# EAGLE design tinyTorch (EAGLE 7.5.0)
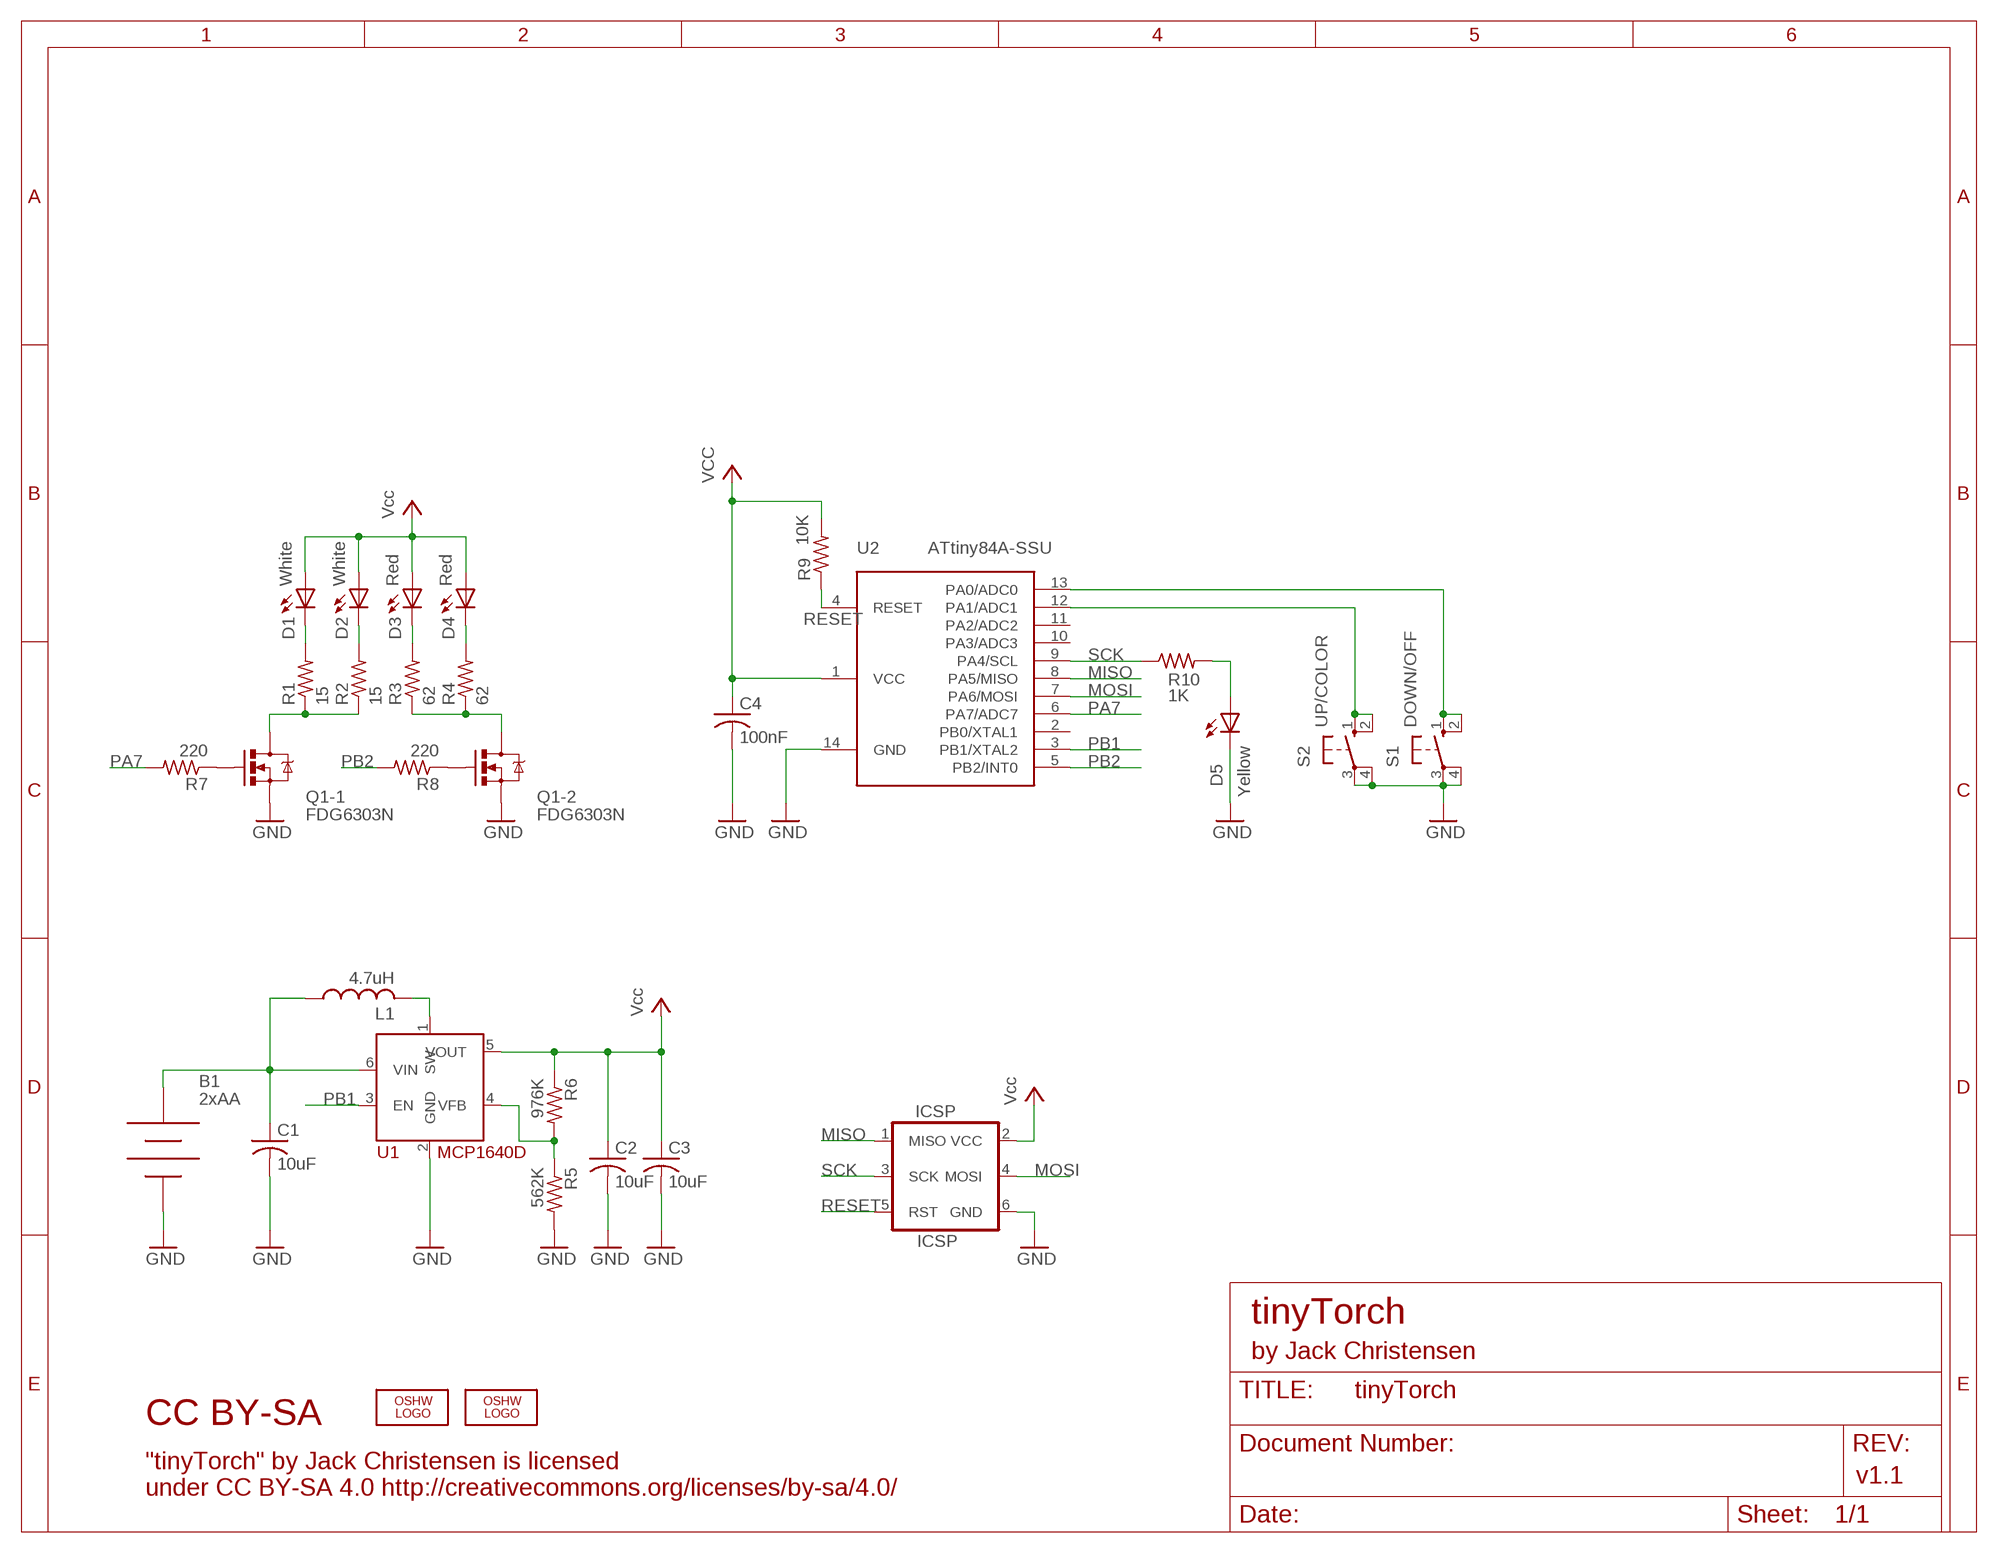
[diagram p0: schematic, sheet 1]

## Parts
B1  2xAA  BATTERY-2AANOHOLES  [KEYSTONE-2462-NO-HOLES]
C1  10uF  C-USM0805  [M0805]
C2  10uF  C-USM0805  [M0805]
C3  10uF  C-USM0805  [M0805]
C4  100nF  C-USM0805  [M0805]
D1  White  LED5MM-LONGPADS  [LED5MM-OVAL]
D2  White  LED5MM-LONGPADS  [LED5MM-OVAL]
D3  Red  LED5MM-LONGPADS  [LED5MM-OVAL]
D4  Red  LED5MM-LONGPADS  [LED5MM-OVAL]
D5  Yellow  LEDD0805A  [D0805A]
ICSP  ICSP  AVR_SPI_PRG_62X3_LOCK  [2X3_LOCK]
L1  4.7uH  INDUCTORC1210K  [C1210K]
LOGO1  OSHW_LOGO_8MILX0150-NT  [OSHW_8X150_NOTEXT]
LOGO2  OSHW_LOGO_10MILX0200-NT  [OSHW_10X200_NOTEXT]
Q1  FDG6303N  DUAL-MOSFET  [SOT363_PHILIPS]
R1  15  R-US_M0805  [M0805]
R2  15  R-US_M0805  [M0805]
R3  62  R-US_M0805  [M0805]
R4  62  R-US_M0805  [M0805]
R5  562K  R-US_M0805  [M0805]
R6  976K  R-US_M0805  [M0805]
R7  220  R-US_M0805  [M0805]
R8  220  R-US_M0805  [M0805]
R9  10K  R-US_M0805  [M0805]
R10  1K  R-US_M0805  [M0805]
S1  DOWN/OFF  10-XXSMT  [TACT-SW-SMT]
S2  UP/COLOR  10-XXSMT  [TACT-SW-SMT]
U1  MCP1640D  MCP1640  [SOT23-6]
U2  ATtiny84A-SSU  ATTINYX4SO14  [SO14]

## Nets
GND: B1.NEG C1.2 C2.2 C3.2 C4.2 D5.K(C) ICSP.6(GND) Q1.1(-1:S) Q1.4(-2:S) R5.2 S1.3(P) S1.4(P1) S2.3(P) S2.4(P1) U1.2(GND) U2.14(GND)
MISO: ICSP.1(MISO) U2.8(PA5/MISO)
MOSI: ICSP.4(MOSI) U2.7(PA6/MOSI)
N$1: Q1.2(-1:G) R7.1
N$2: R5.1 R6.2 U1.4(VFB)
N$3: Q1.5(-2:G) R8.1
N$4: D1.K(C) R1.2
N$5: D5.A R10.2
N$7: L1.2 U1.1(SW)
N$8: D4.K(C) R4.2
N$9: D2.K(C) R2.2
N$10: D3.K(C) R3.2
N$11: B1.POS C1.1 L1.1 U1.6(VIN)
N$13: Q1.6(-1:D) R1.1 R2.1
N$14: Q1.3(-2:D) R3.1 R4.1
N$15: S1.1(S) S1.2(S1) U2.13(PA0/ADC0)
N$16: S2.1(S) S2.2(S1) U2.12(PA1/ADC1)
PA7: R7.2 U2.6(PA7/ADC7)
PB1: U1.3(EN) U2.3(PB1/XTAL2)
PB2: R8.2 U2.5(PB2/INT0)
RESET: ICSP.5(RST) R9.1 U2.4(RESET)
SCK: ICSP.3(SCK) R10.1 U2.9(PA4/SCL)
VCC: C2.1 C3.1 C4.1 D1.A D2.A D3.A D4.A ICSP.2(VCC) R6.1 R9.2 U1.5(VOUT) U2.1(VCC) ; supply symbol labelled Vcc
Unconnected: U2.2(PB0/XTAL1) U2.10(PA3/ADC3) U2.11(PA2/ADC2)

## Notes on the sheet
- tinyTorch
- by Jack Christensen
- CC BY-SA
- v1.1
- "tinyTorch" by Jack Christensen is licensed
  under CC BY-SA 4.0 http://creativecommons.org/licenses/by-sa/4.0/

## Library data of the parts
B1 = _jc:BATTERY-2AA; MFR: Keystone; MFR-PART-NO: 2462
C1-C4 = _jc:C-US: CAPACITOR, American symbol
D1 D2 = _jc:LED: LED OSRAM: - CHIPLED LG R971, LG N971, LY N971, LG Q971, LY Q971, LO R971, LY R971 LH N974, LH R974 LS Q976, LO Q976, LY Q976 LO Q996 - Hyper CHIPLED LW Q18S LB Q993, LB Q99A, LB R99A - SideLED LS A670, LO A670, LY A670, LG A670, LP A670 LB A673, LV A673, LT A673, LW A673 LH A674 LY A675 LS A676, LA A676, LO A676, LY A676, LW A676 LS A679, LY A679, LG A679 - Hyper Micro SIDELED® LS Y876, LA Y876, LO Y876, LY Y876 LT Y87S - SmartLED LW L88C, LW L88S LB L89C, LB L89S, LG L890 LS L89K, LO L89K, LY L89K LS L896, LA L896, LO L896, LY L896 - TOPLED LS T670, LO T670, LY T670, LG T670, LP T670 LSG T670, LSP T670, LSY T670, LOP T670, LYG T670 LG T671, LOG T671, LSG T671 LB T673, LV T673, LT T673, LW T673 LH T674 LS T676, LA T676, LO T676, LY T676, LB T676, LH T676, LSB T676, LW T676 LB T67C, LV T67C, LT T67C, LS T67K, LO T67K, LY T67K, LW E67C LS E67B, LA E67B, LO E67B, LY E67B, LB E67C, LV E67C, LT E67C LW T67C LS T679, LY T679, LG T679 LS T770, LO T770, LY T770, LG T770, LP T770 LB T773, LV T773, LT T773, LW T773 LH T774 LS E675, LA E675, LY E675, LS T675 LS T776, LA T776, LO T776, LY T776, LB T776 LHGB T686 LT T68C, LB T68C - Hyper Mini TOPLED® LB M676 - Mini TOPLED Santana® LG M470 LS M47K, LO M47K, LY M47K Source: http://www.osram.convergy.de/; MFR: Cree; MFR-PART-NO: C503D-WAN-CCBEB151
D3 D4 = _jc:LED: LED OSRAM: - CHIPLED LG R971, LG N971, LY N971, LG Q971, LY Q971, LO R971, LY R971 LH N974, LH R974 LS Q976, LO Q976, LY Q976 LO Q996 - Hyper CHIPLED LW Q18S LB Q993, LB Q99A, LB R99A - SideLED LS A670, LO A670, LY A670, LG A670, LP A670 LB A673, LV A673, LT A673, LW A673 LH A674 LY A675 LS A676, LA A676, LO A676, LY A676, LW A676 LS A679, LY A679, LG A679 - Hyper Micro SIDELED® LS Y876, LA Y876, LO Y876, LY Y876 LT Y87S - SmartLED LW L88C, LW L88S LB L89C, LB L89S, LG L890 LS L89K, LO L89K, LY L89K LS L896, LA L896, LO L896, LY L896 - TOPLED LS T670, LO T670, LY T670, LG T670, LP T670 LSG T670, LSP T670, LSY T670, LOP T670, LYG T670 LG T671, LOG T671, LSG T671 LB T673, LV T673, LT T673, LW T673 LH T674 LS T676, LA T676, LO T676, LY T676, LB T676, LH T676, LSB T676, LW T676 LB T67C, LV T67C, LT T67C, LS T67K, LO T67K, LY T67K, LW E67C LS E67B, LA E67B, LO E67B, LY E67B, LB E67C, LV E67C, LT E67C LW T67C LS T679, LY T679, LG T679 LS T770, LO T770, LY T770, LG T770, LP T770 LB T773, LV T773, LT T773, LW T773 LH T774 LS E675, LA E675, LY E675, LS T675 LS T776, LA T776, LO T776, LY T776, LB T776 LHGB T686 LT T68C, LB T68C - Hyper Mini TOPLED® LB M676 - Mini TOPLED Santana® LG M470 LS M47K, LO M47K, LY M47K Source: http://www.osram.convergy.de/; MFR: Lite-On; MFR-PART-NO: LTL2H3EZ1K
D5 = _jc:LED: LED OSRAM: - CHIPLED LG R971, LG N971, LY N971, LG Q971, LY Q971, LO R971, LY R971 LH N974, LH R974 LS Q976, LO Q976, LY Q976 LO Q996 - Hyper CHIPLED LW Q18S LB Q993, LB Q99A, LB R99A - SideLED LS A670, LO A670, LY A670, LG A670, LP A670 LB A673, LV A673, LT A673, LW A673 LH A674 LY A675 LS A676, LA A676, LO A676, LY A676, LW A676 LS A679, LY A679, LG A679 - Hyper Micro SIDELED® LS Y876, LA Y876, LO Y876, LY Y876 LT Y87S - SmartLED LW L88C, LW L88S LB L89C, LB L89S, LG L890 LS L89K, LO L89K, LY L89K LS L896, LA L896, LO L896, LY L896 - TOPLED LS T670, LO T670, LY T670, LG T670, LP T670 LSG T670, LSP T670, LSY T670, LOP T670, LYG T670 LG T671, LOG T671, LSG T671 LB T673, LV T673, LT T673, LW T673 LH T674 LS T676, LA T676, LO T676, LY T676, LB T676, LH T676, LSB T676, LW T676 LB T67C, LV T67C, LT T67C, LS T67K, LO T67K, LY T67K, LW E67C LS E67B, LA E67B, LO E67B, LY E67B, LB E67C, LV E67C, LT E67C LW T67C LS T679, LY T679, LG T679 LS T770, LO T770, LY T770, LG T770, LP T770 LB T773, LV T773, LT T773, LW T773 LH T774 LS E675, LA E675, LY E675, LS T675 LS T776, LA T776, LO T776, LY T776, LB T776 LHGB T686 LT T68C, LB T68C - Hyper Mini TOPLED® LB M676 - Mini TOPLED Santana® LG M470 LS M47K, LO M47K, LY M47K Source: http://www.osram.convergy.de/; MFR: Lite-On; MFR-PART-NO: LTST-C171KYKT
ICSP = _jc:AVR_SPI_PRG_6: AVR ISP 6 Pin This is the reduced ISP connector for AVR programming. Common on Arduino. This footprint will take up less PCB space and can be used with a 10-pin to 6-pin adapter such as SKU: BOB-08508
L1 = _jc:INDUCTOR: Murata #11R472C; MFR: Taiyo Yuden; MFR-PART-NO: CBC3225T4R7MR
LOGO1 = ohw-logo:OSHW_LOGO_8MIL
LOGO2 = ohw-logo:OSHW_LOGO_10MIL
Q1 = _jc:DUAL-MOSFET: e.g. Fairchild/ON Semi FDG6303N
R1-R10 = _jc:R-US_: RESISTOR, American symbol
S1 S2 = _jc:10-XX: OMRON SWITCH; MFR: Omron; MFR-PART-NO: B3FS-1000
U1 = _jc:MCP1640
U2 = _jc:ATTINYX4

## Board
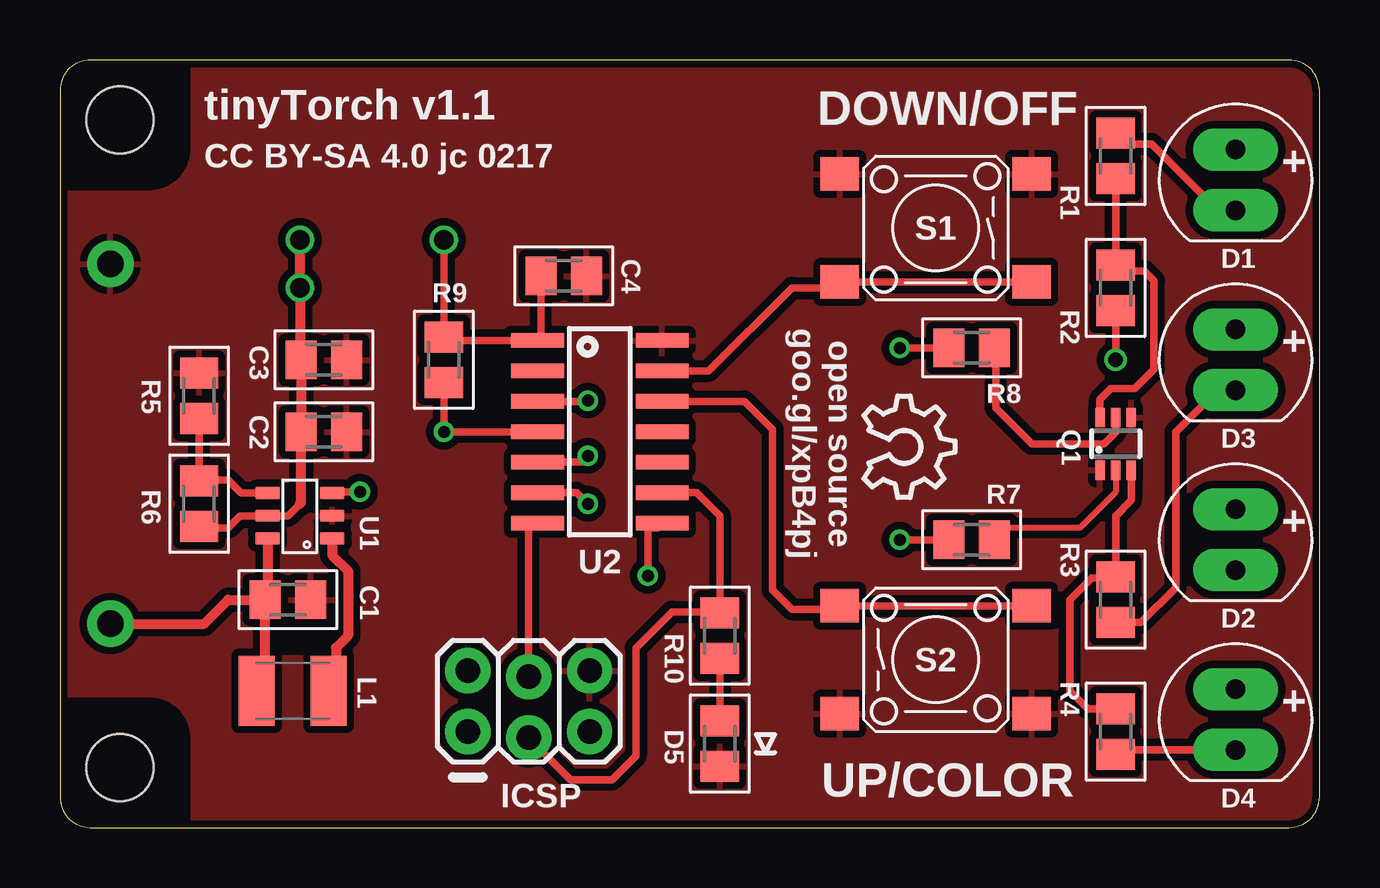
[diagram p1: board, top side]
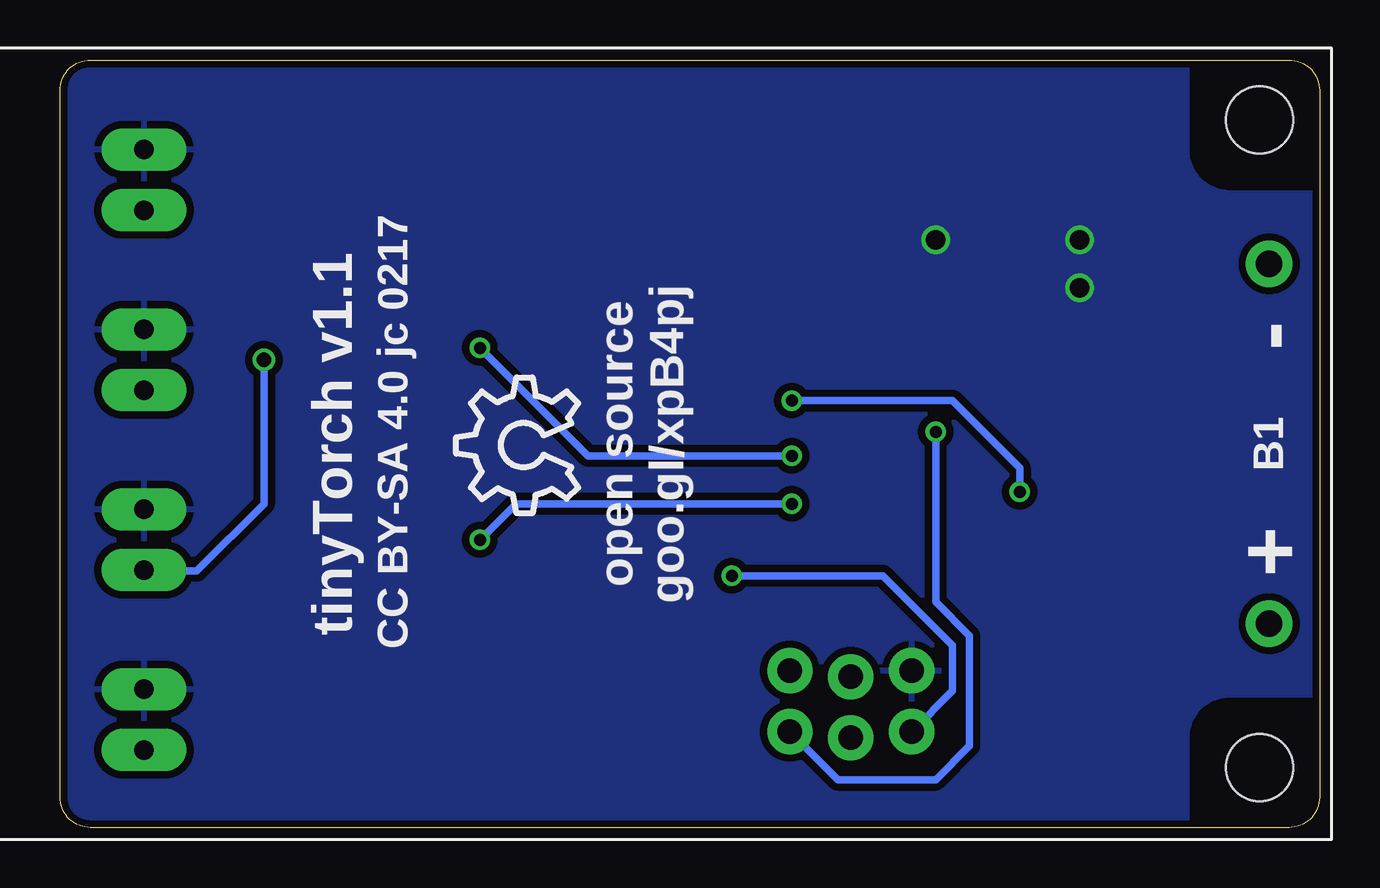
[diagram p2: board, bottom side, seen from below]

Size 52.5 x 32 mm. Coordinates in mm from the lower left corner, seen from the top.
Outline: 0,30.73 0,1.27 arc90 1.27,0 51.23,0 arc90 52.5,1.27 52.5,30.73 arc90 51.23,32 1.27,32 arc90 0,30.73
Copper layers (1*16): Top 0.0356mm / dielectric 1.5011mm / Bottom 0.0356mm
Design rules "oshpark-2layer-jc *": minimum track width 8mil, minimum drill 13mil, track to track 8mil, track to pad 8mil, pad to pad 8mil, via to via 8mil, smd to smd 6mil, copper to edge 12mil, drill to drill 6mil, minimum pad ring 7mil, minimum via ring 7mil, stop-mask expansion 2.5mil, vias tented up to drill 20mil, thermal gap 12mil
Holes 2.8 mm at 2.5,2.5 2.5,29.5
tRestrict: area 9,7.5 to 11,8.5; area 0,27 to 5,32; area 0,0 to 5,5
bRestrict: area 0,27 to 5,32; area 0,0 to 5,5

### Footprints (pad centres in the part's own frame; a part is rotated, then mirrored left to right if it is on the bottom)
KEYSTONE-2462-NO-HOLES = drill 1.1 pad 1.93: NEG 2.6,-7.5; POS 2.6,7.5
M0805 = smd 1.3 x 1.6: 1 -0.95,0; 2 0.95,0
LED5MM-OVAL = drill 0.813 pad 1.778 long: A -1.27,0; K 1.27,0
D0805A = smd 1.3 x 1.6: A -0.95,0; K 0.95,0
2X3_LOCK = drill 1.016 pad 1.88: 1 0,0; 2 0,2.54; 3 2.54,-0.254; 4 2.54,2.286; 5 5.08,0; 6 5.08,2.54
C1210K = smd 1.5 x 2.9: 1 -1.5,0; 2 1.5,0
SOT363_PHILIPS = smd 0.4 x 0.8: 1 -0.65,-1.1; 2 0,-1.1; 3 0.65,-1.1; 4 0.65,1.1; 5 0,1.1; 6 -0.65,1.1
TACT-SW-SMT = smd 1.6 x 1.4: 1 -4,2.25; 2 4,2.25; 3 -4,-2.25; 4 4,-2.25
SOT23-6 = smd 0.508 x 1.016: 1 -0.95,-1.35; 2 0,-1.35; 3 0.95,-1.35; 4 0.95,1.35; 5 0,1.35; 6 -0.95,1.35
SO14 = smd 0.6 x 2.2: 1 -3.81,-2.6; 2 -2.54,-2.6; 3 -1.27,-2.6; 4 0,-2.6; 5 1.27,-2.6; 6 2.54,-2.6; 7 3.81,-2.6; 8 3.81,2.6; 9 2.54,2.6; 10 1.27,2.6; 11 0,2.6; 12 -1.27,2.6; 13 -2.54,2.6; 14 -3.81,2.6

### Placement (x,y rotation side)
B1  -0.5,16 180 bottom
C1  9.5,9.5 0 top
C2  11,16.5 0 top
C3  11,19.5 0 top
C4  21,23 0 top
D1  49,27 270 top
D2  49,12 270 top
D3  49,19.5 270 top
D4  49,4.5 270 top
D5  27.5,3.5 270 top
ICSP  17,4 0 top
L1  9.7,5.7 0 top
LOGO1  33.5,18 270 top
LOGO2  30.9,13.1 90 bottom
Q1  44,16 0 top
R1  44,28 90 top
R2  44,22.5 270 top
R3  44,9.5 270 top
R4  44,4 270 top
R5  5.8,18 90 top
R6  5.8,13.5 90 top
R7  38,12 180 top
R8  38,20 180 top
R9  16,19.5 90 top
R10  27.5,8 270 top
S1  36.5,25 180 top
S2  36.5,7 0 top
U1  10,13 90 top
U2  22.5,16.5 270 top

### Tracks (layer width: path | path; a pad name or v marks a point on that pad's centre or on a via)
GND
  pour Top (isolate 0.305): -1.5,33.5 53.5,33.5 53.5,-1.5 -1.5,-1.5
MISO  (via drill 0.5)
  Top 0.305: v24.5,10.5 24.5,12.5 24.91,12.5 U2.8
  Bottom 0.305: ICSP.1 15.3,5.7 15.3,7.6 18.2,10.5 v24.5,10.5
MOSI
  Top 0.305: ICSP.4 19.54,12.46 19.3,12.7 U2.7
N$1
  Top 0.254: Q1.2 44,14 42.5,12.5 39.45,12.5 R7.1
N$2
  Top 0.305: U1.4 7.55,13.95 7,14.5 5.85,14.5 R6.2 R5.1
N$3
  Top 0.305: Q1.5 44,16.5 43.5,16 40.5,16 39,17.5 39,19.95 R8.1
N$4
  Top 0.305: D1.K 48.27,25.73 45.5,28.5 44.45,28.5 R1.2
N$5
  Top 0.305: R10.2 D5.A
N$7
  Top 0.406: U1.1 11.35,11.35 12,10.7 12,8 11.5,7.5 11.5,6 L1.2
N$8
  Top 0.305: D4.K 44.18,3.23 R4.2
N$9  (via drill 0.6)
  Top 0.305: R2.2 v44,19.5
  Bottom 0.305: v44,19.5 44,13.5 46.8,10.7 48.97,10.7 D2.K
N$10
  Top 0.305: R3.2 45.05,8.55 46.5,10 46.5,16.5 48,18 48.77,18 D3.K
N$11
  Top 0.406: B1.POS 6,8.5 7,9.5 C1.1 | U1.6 8.65,9.6 C1.1 | L1.1 8.55,5.7 C1.1
N$13
  Top 0.305: R1.1 R2.1 44.25,23.2 45.2,23.2 45.6,22.8 45.6,19.1 44.8,18.3 43.8,18.3 43.35,17.85 Q1.6
N$14
  Top 0.305: Q1.3 44.65,13.65 44,13 R3.1 43.95,10.4 43,10.4 42.1,9.5 42.1,5.7 42.85,4.95 R4.1
N$15
  Top 0.305: S1.1 S1.2 32.25,22.5 30.5,22.5 27.04,19.04 U2.13
N$16
  Top 0.305: S2.2 S2.1 31.85,9.1 30.5,9.1 29.7,9.9 29.7,16.6 28.53,17.77 U2.12
PA7  (via drill 0.5)
  Top 0.305: v35,12 R7.2 | U2.6 21.54,13.96 v22,13.5
  Bottom 0.305: v22,13.5 33.5,13.5 v35,12
PB1  (via drill 0.5)
  Top 0.305: v12.5,14 11.4,14 U1.3 | U2.3 21.97,17.77 v22,17.8
  Bottom 0.305: v22,17.8 15.3,17.8 12.5,15 v12.5,14
PB2  (via drill 0.5)
  Top 0.305: v35,20 R8.2 | U2.5 21.73,15.23 v22,15.5
  Bottom 0.305: v22,15.5 30.5,15.5 v35,20
RESET  (via drill 0.5)
  Top 0.305: R9.1 v16,16.5 U2.4
  Bottom 0.305: ICSP.5 20.08,2 16,2 14.6,3.4 14.6,8 16,9.4 v16,16.5
SCK
  Top 0.305: ICSP.3 21.29,2 23,2 24,3 24,7.5 25.5,9 27.05,9 R10.1 27.5,13 26.54,13.96 U2.9
VCC  (via drill 0.8)
  Top 0.305: C4.1 20.05,20.46 U2.1 16.14,20.31 R9.2 v16,24.5 | 10,13.5 9.5,13 U1.5 7.5,13 7,12.5 5.85,12.5 R6.1
  Top 0.406: v10,24.5 v10,22.5 10,19.55 C3.1 C2.1 10.05,13.55 10,13.5
  pour Bottom (isolate 0.305): -1,33 53,33 53,-1 -1,-1

### Text on the board
tPlace: tinyTorch v1.1 | DOWN/OFF | CC BY-SA 4.0 jc 0217 | open source / goo.gl/xpB4pj | UP/COLOR
bPlace: open source / goo.gl/xpB4pj | CC BY-SA 4.0 jc 0217 | tinyTorch v1.1